# Altium schematic sheet SAM3X_MCU2.SchDoc
size A3; SheetNumber: 3; SheetTotal: 8
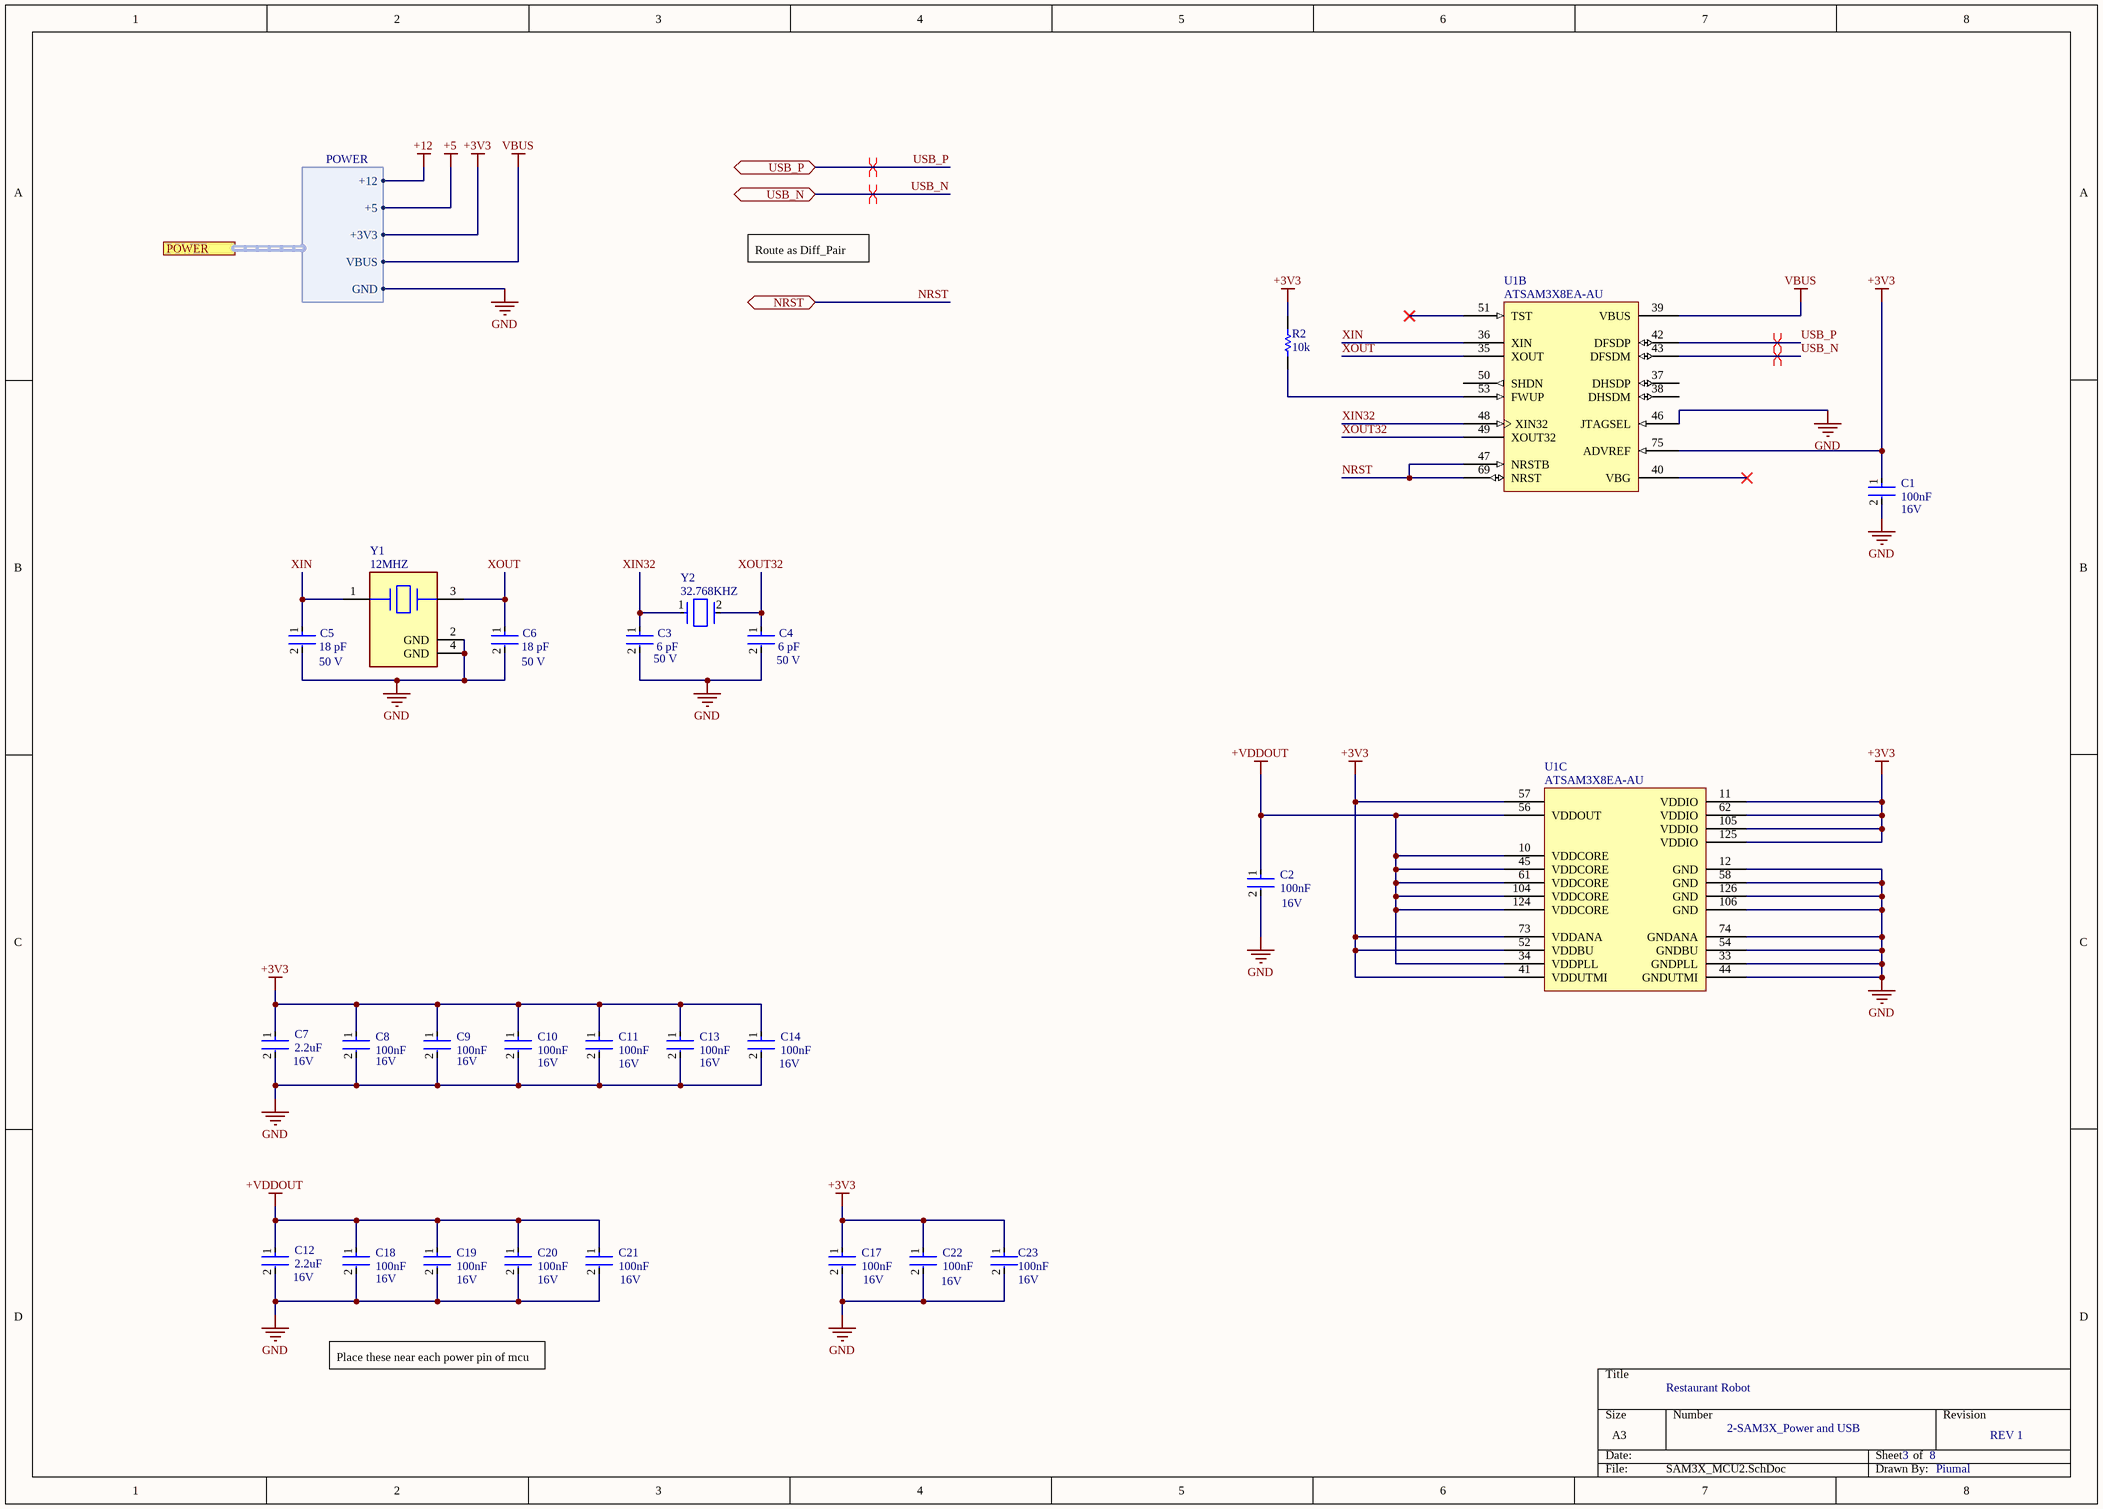
[diagram p0: SAM3X_MCU2.SchDoc]

## Parts
C1  Voltage Rating (DC): 16V  Capacitance: 100nF  [FP-CL21-IPC_A]  (hidden comment: CL21B104KOANNNC)
C2  Voltage Rating (DC): 16V  Capacitance: 100nF  [FP-CL21-IPC_A]  (hidden comment: CL21B104KOANNNC)
C3  Capacitance: 6 pF  Voltage Rating: 50 V  [FP-C0805C-DN-MFG]  (hidden comment: C0805C120J5GACTU)
C4  Capacitance: 6 pF  Voltage Rating: 50 V  [FP-C0805C-DN-MFG]  (hidden comment: C0805C120J5GACTU)
C5  Capacitance: 18 pF  Voltage Rating: 50 V  [FP-C0805C-DN-MFG]  (hidden comment: C0805C120J5GACTU)
C6  Capacitance: 18 pF  Voltage Rating: 50 V  [FP-C0805C-DN-MFG]  (hidden comment: C0805C120J5GACTU)
C7  Voltage Rating: 16V  Capacitance: 2.2uF  [FP-CL21-IPC_A]  (hidden comment: CL21A225KOFNNNG)
C8  Voltage Rating (DC): 16V  Capacitance: 100nF  [FP-CL21-IPC_A]  (hidden comment: CL21B104KOANNNC)
C9  Voltage Rating (DC): 16V  Capacitance: 100nF  [FP-CL21-IPC_A]  (hidden comment: CL21B104KOANNNC)
C10  Voltage Rating (DC): 16V  Capacitance: 100nF  [FP-CL21-IPC_A]  (hidden comment: CL21B104KOANNNC)
C11  Voltage Rating (DC): 16V  Capacitance: 100nF  [FP-CL21-IPC_A]  (hidden comment: CL21B104KOANNNC)
C12  Voltage Rating: 16V  Capacitance: 2.2uF  [FP-CL21-IPC_A]  (hidden comment: CL21A225KOFNNNG)
C13  Voltage Rating (DC): 16V  Capacitance: 100nF  [FP-CL21-IPC_A]  (hidden comment: CL21B104KOANNNC)
C14  Voltage Rating (DC): 16V  Capacitance: 100nF  [FP-CL21-IPC_A]  (hidden comment: CL21B104KOANNNC)
C17  Voltage Rating (DC): 16V  Capacitance: 100nF  [FP-CL21-IPC_A]  (hidden comment: CL21B104KOANNNC)
C18  Voltage Rating (DC): 16V  Capacitance: 100nF  [FP-CL21-IPC_A]  (hidden comment: CL21B104KOANNNC)
C19  Voltage Rating (DC): 16V  Capacitance: 100nF  [FP-CL21-IPC_A]  (hidden comment: CL21B104KOANNNC)
C20  Voltage Rating (DC): 16V  Capacitance: 100nF  [FP-CL21-IPC_A]  (hidden comment: CL21B104KOANNNC)
C21  Voltage Rating (DC): 16V  Capacitance: 100nF  [FP-CL21-IPC_A]  (hidden comment: CL21B104KOANNNC)
C22  Voltage Rating (DC): 16V  Capacitance: 100nF  [FP-CL21-IPC_A]  (hidden comment: CL21B104KOANNNC)
C23  value 100nF  Voltage Rating (DC): 16V  [FP-CL21-IPC_A]  (hidden comment: CL21B104KOANNNC)
R2  Resistance: 10k  [RESC2013X60X35ML10T20]  (hidden comment: RC0805JR-0710KL)
U1  ATSAM3X8EA-AU  [LQFP144_M]  (parts B,C of 3)
Y1  12MHZ  [FP-ABM8G-MFG]
Y2  32.768KHZ  [FP-NX3215SA-MFG]

## Ports
NRST (bidir), POWER (harness POWER), USB_N (bidir), USB_P (bidir)

## Harnesses
POWER: +3V3, GND, +5, VBUS, +12

## Nets
+3V3: C1.1 C7.1 C8.1 C9.1 C10.1 C11.1 C13.1 C14.1 C17.1 C22.1 C23.1 R2.2 U1.11(VDDIO) U1.41(VDDUTMI) U1.52(VDDBU) U1.57(VDDIN) U1.62(VDDIO) U1.73(VDDANA) U1.75(ADVREF) U1.105(VDDIO) U1.125(VDDIO) ; port POWER.+3V3
+5: port POWER.+5
+12: port POWER.+12
+VDDOUT: C2.1 C12.1 C18.1 C19.1 C20.1 C21.1 U1.10(VDDCORE) U1.34(VDDPLL) U1.45(VDDCORE) U1.56(VDDOUT) U1.61(VDDCORE) U1.104(VDDCORE) U1.124(VDDCORE)
GND: C1.2 C2.2 C3.2 C4.2 C5.2 C6.2 C7.2 C8.2 C9.2 C10.2 C11.2 C12.2 C13.2 C14.2 C17.2 C18.2 C19.2 C20.2 C21.2 C22.2 C23.2 U1.12(GND) U1.33(GNDPLL) U1.44(GNDUTMI) U1.46(JTAGSEL) U1.54(GNDBU) U1.58(GND) U1.74(GNDANA) U1.106(GND) U1.126(GND) Y1.2(GND) Y1.4(GND) ; port POWER.GND
VBUS: U1.39(VBUS) ; port POWER.VBUS
NRST: U1.47(NRSTB) U1.69(NRST) ; port NRST
USB_N: U1.43(DFSDM) ; port USB_N
USB_P: U1.42(DFSDP) ; port USB_P
XIN: C5.1 U1.36(XIN) Y1.1
XIN32: C3.1 U1.48(XIN32) Y2.1
XOUT: C6.1 U1.35(XOUT) Y1.3
XOUT32: C4.1 U1.49(XOUT32) Y2.2
NetR2_1: R2.1 U1.53(FWUP)

Not connected (* = marked no-connect by the designer): U1 37(DHSDP) 38(DHSDM) 40(VBG)* 50(SHDN) 51(TST)*

## Layout directives
differential pair; rule Signal Stimulus [Kind - Single Pulse    Level - High    Start Time = 0.000    Stop Time = 41.67    Period Time = 83.33]: USB_P
differential pair: USB_N, USB_P

## Notes on the sheet
- Route as Diff_Pair
- Place these near each power pin of mcu
- Restaurant Robot
- 2-SAM3X_Power and USB
- 3
- 8
- REV 1
- Piumal

## Library data of the parts
C1 C2 C8-C11 C13 C14 C17-C23 = CMP-13271-003679-1: CL21 Series 0805 100nF 16V ±10% Tolerance X7R Multilayer Ceramic Chip Capacitor; Lead Free: Lead Free; Width: 0.049inch; Tolerance: 10%; Min Operating Temperature: -55°C; Dielectric: X7R; Case Code (Metric): 2012; Packaging: Tape and Reel; Radiation Hardening: No; Length: 2mm; Height: 0.65mm; Voltage Rating: 16V; Mount: Surface Mount; Max Operating Temperature: 125°C; Depth: 1.25mm; Thickness: 0.03inch; Case Code (Imperial): 0805; Case/Package: 0805; Package Quantity: 1
C3-C6 = CMP-2007-00441-2: CAP CER 12PF 50V C0G/NP0 0805; Manufacturer: KEMET; Temperature Characteristic: C0G; Temperature Coefficient: 30ppm/°C; Material: Ceramic; Tolerance: 0.05; Height: 0.88mm; ComponentLink2URL: https://content.kemet.com/datasheets/KEM_C1003_C0G_SMD.pdf; Automotive: No; Device Class L2: Capacitors; Digikey Description: CAP CER 12PF 50V C0G/NP0 0805; Value: 12 pF; Device Class L3: Ceramic Capacitors; Mouser Description: Multilayer Ceramic Capacitors MLCC - SMD/SMT 50volts 12pF C0G 5%; Device Class L1: Passive Components; ComponentLink2Description: Datasheet; RoHS: TRUE; Temperature Range High: +125°C; Lead Free: Yes; Category: Cap; Ipc Land Pattern Name: CAPC200125X78; Package: C0805C-DN; Manufacturer Part Number: C0805C120J5GACTU; Octopart: https://octopart.com/c0805c120j5gactu-kemet-126518; Temperature Range Low: -55°C; Temperature: -55°C to +125°C
C7 C12 = CMP-13271-001347-1: CL21 Series 0805 2.2uF 16V ±10% Tolerance X5R Multilayer Ceramic Chip Capacitor; Width: 0.049inch; Min Operating Temperature: -55°C; Length: 0.079inch; Mount: Surface Mount; Tolerance: 10%; Package Quantity: 3000; Case Code (Imperial): 0805; Case Code (Metric): 2012; Thickness: 0.053inch; Packaging: Tape and Reel; Case/Package: 0805; Max Operating Temperature: 85°C
R2 = CMP-2000-05025-1: Chip Resistor, 10 KOhm, +/- 5%, 0.125 W, -55 to 155 degC, 0805 (2012 Metric), RoHS, Tape and Reel; Manufacturer: Yageo; Resistor Element Type: ThickFilm; Voltage Rating: 150V; Product Range: RCSeries; SVHC: ToBeAdvised; Resistor Case Style: 0805[2012Metric]; Temperature Coefficient: ±100ppm/degC; Power Rating: 250mW; Automotive Qualification Standard: -; Datasheet Version: REV. 2, 09/2004; Packaging: CutTape; Resistance Tolerance: ±5%; MSL: MSL1-Unlimited; Manufacturer URL: http://www.yageo.com/; Datasheet URL: http://www.yageo.ru/pdf/RC0805.pdf; Package Description: 2-Pin Surface Mounted Device, Body 2 x 1.25 mm; Package Reference: 805
U1 = CMP-0076-00188-1: SAM3X ARM Cortex-M3 Flash-based Microcontroller, 512 KB Flash, 96 KB SRAM, 103 User I/Os, 1.62 to 3.6 V, -40 to 85 degC, 144-Pin LQFP, RoHS; Manufacturer: Atmel; UART: 5; Max. Operating Freq.: 84 MHz; ADC Resolution: 12 bits; Flash: 512 Kbytes; ADC Channels: 16; SRAM: 96 Kbytes; Max I/O Pins: 103; DAC Channels: 2; SPI: 4; # of Touch Channels: 32; Mounting Technology: Surface Mount; Operating Voltage: 1.62 to 3.6 V; ComponentLink2URL: http://www.atmel.com/Images/doc11057.pdf; CAN: 2; ComponentLink1Description: Manufacturer URL; RoHS: TRUE; PartNumber: ATSAM3X8EA-AU; Temp. Range: -40 to 85 degC; PackageVersion: 11057B; PackageDescription: 100-Pin Quad Flat Package, Body 20 x 20 mm, Pitch 0.5 mm; ComponentLink2Description: Datasheet; DatasheetVersion: 11057B; ComponentLink1URL: http://www.atmel.com/; ComponentLink3Description: Package Specification; ComponentLink3URL: http://www.atmel.com/Images/doc11057.pdf; PackageReference: LQFP-144
Y1 = CMP-2000-05039-3: Crystal 12MHz ±20ppm (Tol) ±30ppm (Stability) 18pF FUND 120Ω 4-Pin SMD T/R; Series Resistance: 120R; Max Operating Temperature: 85°C; Mount: Surface Mount; Width: 2.5mm; Series: ABM8G; Termination: SMD/SMT; Frequency Tolerance: 20ppm; Tolerance: 20ppm; Min Operating Temperature: -40°C; Operating Frequency: 12 MHz; Depth: 2.5mm; Load Capacitance: 18pF; Number of Pins: 4; Length: 3.2mm; Radiation Hardening: No; Frequency Stability: 30ppm; Height: 1mm; Packaging: Tape and Reel; Package Quantity: 1000; ESR (Equivalent Series Resistance): 120R; Lead Free: Lead Free; Frequency: 12MHz; Case/Package: CSMD; Parameter 1: *
Y2 = CMP-00536-22488149-1: NX3215SA-32.768K-STD-MUA-14 Parallel - Fundamental Quartz Crystal, 0.032768MHz Nom; ESR (Equivalent Series Resistance): 70kΩ; Frequency Tolerance: 0.002%; Load Capacitance: 6pF; Width: 1.4986mm; Length: 3.2004mm; RoHS: Compliant; Case/Package: SMD/SMT; Mount: Surface Mount; Height: 889µm; Number of Pins: 2; Packaging: Tape & Reel (TR); Max Operating Temperature: 85°C; Frequency: 32.768kHz; NexarPartId: 22488149; Min Operating Temperature: -40°C